# Altium project PCB_Divergence Meter.PrjPCB
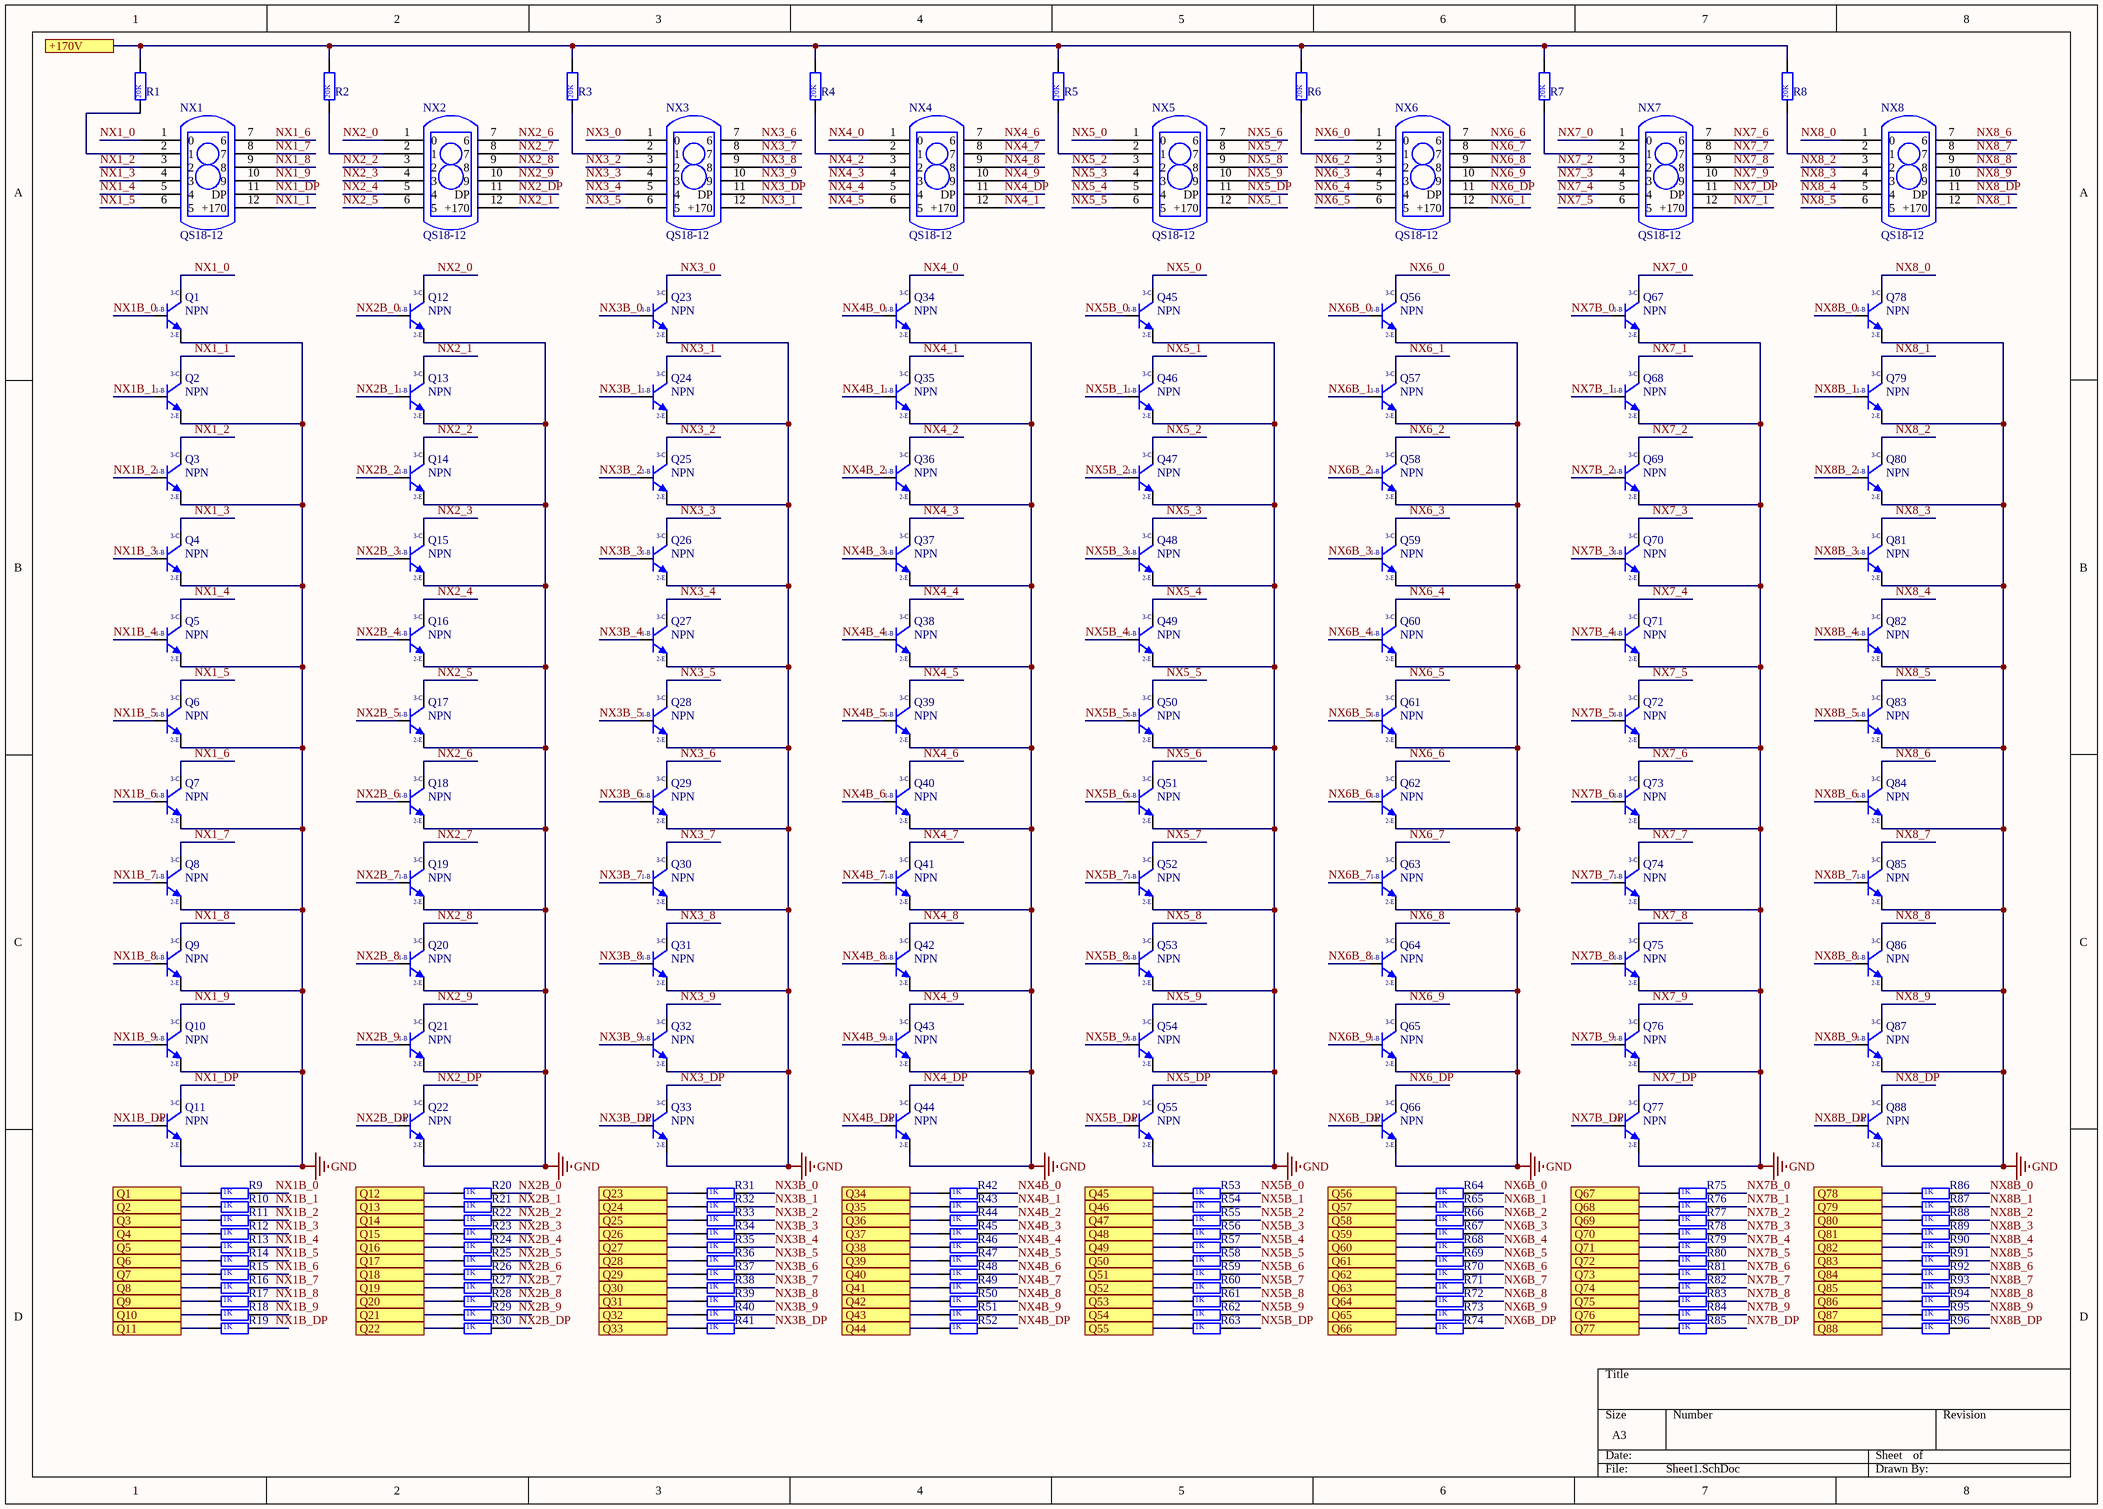
[diagram p0: Sheet1.SchDoc]
2 sheets, 224 parts. Net scope: flat (ports and power ports of the same name join across sheets).
Board file: PCB1.PcbDoc
Sheets:
  Sheet1.SchDoc
  Sheet2.SchDoc

## Sheet Sheet1.SchDoc
size A3

### Parts
NX1  QS18-12  [PCBComponent_1]
NX2  QS18-12  [PCBComponent_1]
NX3  QS18-12  [PCBComponent_1]
NX4  QS18-12  [PCBComponent_1]
NX5  QS18-12  [PCBComponent_1]
NX6  QS18-12  [PCBComponent_1]
NX7  QS18-12  [PCBComponent_1]
NX8  QS18-12  [PCBComponent_1]
Q1  NPN  [SOT-23]
Q2  NPN  [SOT-23]
Q3  NPN  [SOT-23]
Q4  NPN  [SOT-23]
Q5  NPN  [SOT-23]
Q6  NPN  [SOT-23]
Q7  NPN  [SOT-23]
Q8  NPN  [SOT-23]
Q9  NPN  [SOT-23]
Q10  NPN  [SOT-23]
Q11  NPN  [SOT-23]
Q12  NPN  [SOT-23]
Q13  NPN  [SOT-23]
Q14  NPN  [SOT-23]
Q15  NPN  [SOT-23]
Q16  NPN  [SOT-23]
Q17  NPN  [SOT-23]
Q18  NPN  [SOT-23]
Q19  NPN  [SOT-23]
Q20  NPN  [SOT-23]
Q21  NPN  [SOT-23]
Q22  NPN  [SOT-23]
Q23  NPN  [SOT-23]
Q24  NPN  [SOT-23]
Q25  NPN  [SOT-23]
Q26  NPN  [SOT-23]
Q27  NPN  [SOT-23]
Q28  NPN  [SOT-23]
Q29  NPN  [SOT-23]
Q30  NPN  [SOT-23]
Q31  NPN  [SOT-23]
Q32  NPN  [SOT-23]
Q33  NPN  [SOT-23]
Q34  NPN  [SOT-23]
Q35  NPN  [SOT-23]
Q36  NPN  [SOT-23]
Q37  NPN  [SOT-23]
Q38  NPN  [SOT-23]
Q39  NPN  [SOT-23]
Q40  NPN  [SOT-23]
Q41  NPN  [SOT-23]
Q42  NPN  [SOT-23]
Q43  NPN  [SOT-23]
Q44  NPN  [SOT-23]
Q45  NPN  [SOT-23]
Q46  NPN  [SOT-23]
Q47  NPN  [SOT-23]
Q48  NPN  [SOT-23]
Q49  NPN  [SOT-23]
Q50  NPN  [SOT-23]
Q51  NPN  [SOT-23]
Q52  NPN  [SOT-23]
Q53  NPN  [SOT-23]
Q54  NPN  [SOT-23]
Q55  NPN  [SOT-23]
Q56  NPN  [SOT-23]
Q57  NPN  [SOT-23]
Q58  NPN  [SOT-23]
Q59  NPN  [SOT-23]
Q60  NPN  [SOT-23]
Q61  NPN  [SOT-23]
Q62  NPN  [SOT-23]
Q63  NPN  [SOT-23]
Q64  NPN  [SOT-23]
Q65  NPN  [SOT-23]
Q66  NPN  [SOT-23]
Q67  NPN  [SOT-23]
Q68  NPN  [SOT-23]
Q69  NPN  [SOT-23]
Q70  NPN  [SOT-23]
Q71  NPN  [SOT-23]
Q72  NPN  [SOT-23]
Q73  NPN  [SOT-23]
Q74  NPN  [SOT-23]
Q75  NPN  [SOT-23]
Q76  NPN  [SOT-23]
Q77  NPN  [SOT-23]
Q78  NPN  [SOT-23]
Q79  NPN  [SOT-23]
Q80  NPN  [SOT-23]
Q81  NPN  [SOT-23]
Q82  NPN  [SOT-23]
Q83  NPN  [SOT-23]
Q84  NPN  [SOT-23]
Q85  NPN  [SOT-23]
Q86  NPN  [SOT-23]
Q87  NPN  [SOT-23]
Q88  NPN  [SOT-23]
R1  value 20K  [0805]  (hidden comment: R)
R2  value 20K  [0805]  (hidden comment: R)
R3  value 20K  [0805]  (hidden comment: R)
R4  value 20K  [0805]  (hidden comment: R)
R5  value 20K  [0805]  (hidden comment: R)
R6  value 20K  [0805]  (hidden comment: R)
R7  value 20K  [0805]  (hidden comment: R)
R8  value 20K  [0805]  (hidden comment: R)
R9  value 1K  [0805]  (hidden comment: R)
R10  value 1K  [0805]  (hidden comment: R)
R11  value 1K  [0805]  (hidden comment: R)
R12  value 1K  [0805]  (hidden comment: R)
R13  value 1K  [0805]  (hidden comment: R)
R14  value 1K  [0805]  (hidden comment: R)
R15  value 1K  [0805]  (hidden comment: R)
R16  value 1K  [0805]  (hidden comment: R)
R17  value 1K  [0805]  (hidden comment: R)
R18  value 1K  [0805]  (hidden comment: R)
R19  value 1K  [0805]  (hidden comment: R)
R20  value 1K  [0805]  (hidden comment: R)
R21  value 1K  [0805]  (hidden comment: R)
R22  value 1K  [0805]  (hidden comment: R)
R23  value 1K  [0805]  (hidden comment: R)
R24  value 1K  [0805]  (hidden comment: R)
R25  value 1K  [0805]  (hidden comment: R)
R26  value 1K  [0805]  (hidden comment: R)
R27  value 1K  [0805]  (hidden comment: R)
R28  value 1K  [0805]  (hidden comment: R)
R29  value 1K  [0805]  (hidden comment: R)
R30  value 1K  [0805]  (hidden comment: R)
R31  value 1K  [0805]  (hidden comment: R)
R32  value 1K  [0805]  (hidden comment: R)
R33  value 1K  [0805]  (hidden comment: R)
R34  value 1K  [0805]  (hidden comment: R)
R35  value 1K  [0805]  (hidden comment: R)
R36  value 1K  [0805]  (hidden comment: R)
R37  value 1K  [0805]  (hidden comment: R)
R38  value 1K  [0805]  (hidden comment: R)
R39  value 1K  [0805]  (hidden comment: R)
R40  value 1K  [0805]  (hidden comment: R)
R41  value 1K  [0805]  (hidden comment: R)
R42  value 1K  [0805]  (hidden comment: R)
R43  value 1K  [0805]  (hidden comment: R)
R44  value 1K  [0805]  (hidden comment: R)
R45  value 1K  [0805]  (hidden comment: R)
R46  value 1K  [0805]  (hidden comment: R)
R47  value 1K  [0805]  (hidden comment: R)
R48  value 1K  [0805]  (hidden comment: R)
R49  value 1K  [0805]  (hidden comment: R)
R50  value 1K  [0805]  (hidden comment: R)
R51  value 1K  [0805]  (hidden comment: R)
R52  value 1K  [0805]  (hidden comment: R)
R53  value 1K  [0805]  (hidden comment: R)
R54  value 1K  [0805]  (hidden comment: R)
R55  value 1K  [0805]  (hidden comment: R)
R56  value 1K  [0805]  (hidden comment: R)
R57  value 1K  [0805]  (hidden comment: R)
R58  value 1K  [0805]  (hidden comment: R)
R59  value 1K  [0805]  (hidden comment: R)
R60  value 1K  [0805]  (hidden comment: R)
R61  value 1K  [0805]  (hidden comment: R)
R62  value 1K  [0805]  (hidden comment: R)
R63  value 1K  [0805]  (hidden comment: R)
R64  value 1K  [0805]  (hidden comment: R)
R65  value 1K  [0805]  (hidden comment: R)
R66  value 1K  [0805]  (hidden comment: R)
R67  value 1K  [0805]  (hidden comment: R)
R68  value 1K  [0805]  (hidden comment: R)
R69  value 1K  [0805]  (hidden comment: R)
R70  value 1K  [0805]  (hidden comment: R)
R71  value 1K  [0805]  (hidden comment: R)
R72  value 1K  [0805]  (hidden comment: R)
R73  value 1K  [0805]  (hidden comment: R)
R74  value 1K  [0805]  (hidden comment: R)
R75  value 1K  [0805]  (hidden comment: R)
R76  value 1K  [0805]  (hidden comment: R)
R77  value 1K  [0805]  (hidden comment: R)
R78  value 1K  [0805]  (hidden comment: R)
R79  value 1K  [0805]  (hidden comment: R)
R80  value 1K  [0805]  (hidden comment: R)
R81  value 1K  [0805]  (hidden comment: R)
R82  value 1K  [0805]  (hidden comment: R)
R83  value 1K  [0805]  (hidden comment: R)
R84  value 1K  [0805]  (hidden comment: R)
R85  value 1K  [0805]  (hidden comment: R)
R86  value 1K  [0805]  (hidden comment: R)
R87  value 1K  [0805]  (hidden comment: R)
R88  value 1K  [0805]  (hidden comment: R)
R89  value 1K  [0805]  (hidden comment: R)
R90  value 1K  [0805]  (hidden comment: R)
R91  value 1K  [0805]  (hidden comment: R)
R92  value 1K  [0805]  (hidden comment: R)
R93  value 1K  [0805]  (hidden comment: R)
R94  value 1K  [0805]  (hidden comment: R)
R95  value 1K  [0805]  (hidden comment: R)
R96  value 1K  [0805]  (hidden comment: R)

### Ports
+170V, Q1, Q2, Q3, Q4, Q5, Q6, Q7, Q8, Q9, Q10, Q11, Q12, Q13, Q14, Q15, Q16, Q17, Q18, Q19, Q20, Q21, Q22, Q23, Q24, Q25, Q26, Q27, Q28, Q29, Q30, Q31, Q32, Q33, Q34, Q35, Q36, Q37, Q38, Q39, Q40, Q41, Q42, Q43, Q44, Q45, Q46, Q47, Q48, Q49, Q50, Q51, Q52, Q53, Q54, Q55, Q56, Q57, Q58, Q59, Q60, Q61, Q62, Q63, Q64, Q65, Q66, Q67, Q68, Q69, Q70, Q71, Q72, Q73, Q74, Q75, Q76, Q77, Q78, Q79, Q80, Q81, Q82, Q83, Q84, Q85, Q86, Q87, Q88

### Nets
GND: Q1.2(E) Q2.2(E) Q3.2(E) Q4.2(E) Q5.2(E) Q6.2(E) Q7.2(E) Q8.2(E) Q9.2(E) Q10.2(E) Q11.2(E) Q12.2(E) Q13.2(E) Q14.2(E) Q15.2(E) Q16.2(E) Q17.2(E) Q18.2(E) Q19.2(E) Q20.2(E) Q21.2(E) Q22.2(E) Q23.2(E) Q24.2(E) Q25.2(E) Q26.2(E) Q27.2(E) Q28.2(E) Q29.2(E) Q30.2(E) Q31.2(E) Q32.2(E) Q33.2(E) Q34.2(E) Q35.2(E) Q36.2(E) Q37.2(E) Q38.2(E) Q39.2(E) Q40.2(E) Q41.2(E) Q42.2(E) Q43.2(E) Q44.2(E) Q45.2(E) Q46.2(E) Q47.2(E) Q48.2(E) Q49.2(E) Q50.2(E) Q51.2(E) Q52.2(E) Q53.2(E) Q54.2(E) Q55.2(E) Q56.2(E) Q57.2(E) Q58.2(E) Q59.2(E) Q60.2(E) Q61.2(E) Q62.2(E) Q63.2(E) Q64.2(E) Q65.2(E) Q66.2(E) Q67.2(E) Q68.2(E) Q69.2(E) Q70.2(E) Q71.2(E) Q72.2(E) Q73.2(E) Q74.2(E) Q75.2(E) Q76.2(E) Q77.2(E) Q78.2(E) Q79.2(E) Q80.2(E) Q81.2(E) Q82.2(E) Q83.2(E) Q84.2(E) Q85.2(E) Q86.2(E) Q87.2(E) Q88.2(E)
NX1_0: NX1.1(0) Q1.3(C)
NX1_1: NX1.12(+170) Q2.3(C)
NX1_2: NX1.3(2) Q3.3(C)
NX1_3: NX1.4(3) Q4.3(C)
NX1_4: NX1.5(4) Q5.3(C)
NX1_5: NX1.6(5) Q6.3(C)
NX1_6: NX1.7(6) Q7.3(C)
NX1_7: NX1.8(7) Q8.3(C)
NX1_8: NX1.9(8) Q9.3(C)
NX1_9: NX1.10(9) Q10.3(C)
NX1_DP: NX1.11(DP) Q11.3(C)
NX1B_0: Q1.1(B) R9.2
NX1B_1: Q2.1(B) R10.2
NX1B_2: Q3.1(B) R11.2
NX1B_3: Q4.1(B) R12.2
NX1B_4: Q5.1(B) R13.2
NX1B_5: Q6.1(B) R14.2
NX1B_6: Q7.1(B) R15.2
NX1B_7: Q8.1(B) R16.2
NX1B_8: Q9.1(B) R17.2
NX1B_9: Q10.1(B) R18.2
NX1B_DP: Q11.1(B) R19.2
NX2_0: NX2.1(0) Q12.3(C)
NX2_1: NX2.12(+170) Q13.3(C)
NX2_2: NX2.3(2) Q14.3(C)
NX2_3: NX2.4(3) Q15.3(C)
NX2_4: NX2.5(4) Q16.3(C)
NX2_5: NX2.6(5) Q17.3(C)
NX2_6: NX2.7(6) Q18.3(C)
NX2_7: NX2.8(7) Q19.3(C)
NX2_8: NX2.9(8) Q20.3(C)
NX2_9: NX2.10(9) Q21.3(C)
NX2_DP: NX2.11(DP) Q22.3(C)
NX2B_0: Q12.1(B) R20.2
NX2B_1: Q13.1(B) R21.2
NX2B_2: Q14.1(B) R22.2
NX2B_3: Q15.1(B) R23.2
NX2B_4: Q16.1(B) R24.2
NX2B_5: Q17.1(B) R25.2
NX2B_6: Q18.1(B) R26.2
NX2B_7: Q19.1(B) R27.2
NX2B_8: Q20.1(B) R28.2
NX2B_9: Q21.1(B) R29.2
NX2B_DP: Q22.1(B) R30.2
NX3_0: NX3.1(0) Q23.3(C)
NX3_1: NX3.12(+170) Q24.3(C)
NX3_2: NX3.3(2) Q25.3(C)
NX3_3: NX3.4(3) Q26.3(C)
NX3_4: NX3.5(4) Q27.3(C)
NX3_5: NX3.6(5) Q28.3(C)
NX3_6: NX3.7(6) Q29.3(C)
NX3_7: NX3.8(7) Q30.3(C)
NX3_8: NX3.9(8) Q31.3(C)
NX3_9: NX3.10(9) Q32.3(C)
NX3_DP: NX3.11(DP) Q33.3(C)
NX3B_0: Q23.1(B) R31.2
NX3B_1: Q24.1(B) R32.2
NX3B_2: Q25.1(B) R33.2
NX3B_3: Q26.1(B) R34.2
NX3B_4: Q27.1(B) R35.2
NX3B_5: Q28.1(B) R36.2
NX3B_6: Q29.1(B) R37.2
NX3B_7: Q30.1(B) R38.2
NX3B_8: Q31.1(B) R39.2
NX3B_9: Q32.1(B) R40.2
NX3B_DP: Q33.1(B) R41.2
NX4_0: NX4.1(0) Q34.3(C)
NX4_1: NX4.12(+170) Q35.3(C)
NX4_2: NX4.3(2) Q36.3(C)
NX4_3: NX4.4(3) Q37.3(C)
NX4_4: NX4.5(4) Q38.3(C)
NX4_5: NX4.6(5) Q39.3(C)
NX4_6: NX4.7(6) Q40.3(C)
NX4_7: NX4.8(7) Q41.3(C)
NX4_8: NX4.9(8) Q42.3(C)
NX4_9: NX4.10(9) Q43.3(C)
NX4_DP: NX4.11(DP) Q44.3(C)
NX4B_0: Q34.1(B) R42.2
NX4B_1: Q35.1(B) R43.2
NX4B_2: Q36.1(B) R44.2
NX4B_3: Q37.1(B) R45.2
NX4B_4: Q38.1(B) R46.2
NX4B_5: Q39.1(B) R47.2
NX4B_6: Q40.1(B) R48.2
NX4B_7: Q41.1(B) R49.2
NX4B_8: Q42.1(B) R50.2
NX4B_9: Q43.1(B) R51.2
NX4B_DP: Q44.1(B) R52.2
NX5_0: NX5.1(0) Q45.3(C)
NX5_1: NX5.12(+170) Q46.3(C)
NX5_2: NX5.3(2) Q47.3(C)
NX5_3: NX5.4(3) Q48.3(C)
NX5_4: NX5.5(4) Q49.3(C)
NX5_5: NX5.6(5) Q50.3(C)
NX5_6: NX5.7(6) Q51.3(C)
NX5_7: NX5.8(7) Q52.3(C)
NX5_8: NX5.9(8) Q53.3(C)
NX5_9: NX5.10(9) Q54.3(C)
NX5_DP: NX5.11(DP) Q55.3(C)
NX5B_0: Q45.1(B) R53.2
NX5B_1: Q46.1(B) R54.2
NX5B_2: Q47.1(B) R55.2
NX5B_3: Q48.1(B) R56.2
NX5B_4: Q49.1(B) R57.2
NX5B_5: Q50.1(B) R58.2
NX5B_6: Q51.1(B) R59.2
NX5B_7: Q52.1(B) R60.2
NX5B_8: Q53.1(B) R61.2
NX5B_9: Q54.1(B) R62.2
NX5B_DP: Q55.1(B) R63.2
NX6_0: NX6.1(0) Q56.3(C)
NX6_1: NX6.12(+170) Q57.3(C)
NX6_2: NX6.3(2) Q58.3(C)
NX6_3: NX6.4(3) Q59.3(C)
NX6_4: NX6.5(4) Q60.3(C)
NX6_5: NX6.6(5) Q61.3(C)
NX6_6: NX6.7(6) Q62.3(C)
NX6_7: NX6.8(7) Q63.3(C)
NX6_8: NX6.9(8) Q64.3(C)
NX6_9: NX6.10(9) Q65.3(C)
NX6_DP: NX6.11(DP) Q66.3(C)
NX6B_0: Q56.1(B) R64.2
NX6B_1: Q57.1(B) R65.2
NX6B_2: Q58.1(B) R66.2
NX6B_3: Q59.1(B) R67.2
NX6B_4: Q60.1(B) R68.2
NX6B_5: Q61.1(B) R69.2
NX6B_6: Q62.1(B) R70.2
NX6B_7: Q63.1(B) R71.2
NX6B_8: Q64.1(B) R72.2
NX6B_9: Q65.1(B) R73.2
NX6B_DP: Q66.1(B) R74.2
NX7_0: NX7.1(0) Q67.3(C)
NX7_1: NX7.12(+170) Q68.3(C)
NX7_2: NX7.3(2) Q69.3(C)
NX7_3: NX7.4(3) Q70.3(C)
NX7_4: NX7.5(4) Q71.3(C)
NX7_5: NX7.6(5) Q72.3(C)
NX7_6: NX7.7(6) Q73.3(C)
NX7_7: NX7.8(7) Q74.3(C)
NX7_8: NX7.9(8) Q75.3(C)
NX7_9: NX7.10(9) Q76.3(C)
NX7_DP: NX7.11(DP) Q77.3(C)
NX7B_0: Q67.1(B) R75.2
NX7B_1: Q68.1(B) R76.2
NX7B_2: Q69.1(B) R77.2
NX7B_3: Q70.1(B) R78.2
NX7B_4: Q71.1(B) R79.2
NX7B_5: Q72.1(B) R80.2
NX7B_6: Q73.1(B) R81.2
NX7B_7: Q74.1(B) R82.2
NX7B_8: Q75.1(B) R83.2
NX7B_9: Q76.1(B) R84.2
NX7B_DP: Q77.1(B) R85.2
NX8_0: NX8.1(0) Q78.3(C)
NX8_1: NX8.12(+170) Q79.3(C)
NX8_2: NX8.3(2) Q80.3(C)
NX8_3: NX8.4(3) Q81.3(C)
NX8_4: NX8.5(4) Q82.3(C)
NX8_5: NX8.6(5) Q83.3(C)
NX8_6: NX8.7(6) Q84.3(C)
NX8_7: NX8.8(7) Q85.3(C)
NX8_8: NX8.9(8) Q86.3(C)
NX8_9: NX8.10(9) Q87.3(C)
NX8_DP: NX8.11(DP) Q88.3(C)
NX8B_0: Q78.1(B) R86.2
NX8B_1: Q79.1(B) R87.2
NX8B_2: Q80.1(B) R88.2
NX8B_3: Q81.1(B) R89.2
NX8B_4: Q82.1(B) R90.2
NX8B_5: Q83.1(B) R91.2
NX8B_6: Q84.1(B) R92.2
NX8B_7: Q85.1(B) R93.2
NX8B_8: Q86.1(B) R94.2
NX8B_9: Q87.1(B) R95.2
NX8B_DP: Q88.1(B) R96.2
NetNX1_2: NX1.2(1) R1.1
NetNX2_2: NX2.2(1) R2.1
NetNX3_2: NX3.2(1) R3.1
NetNX4_2: NX4.2(1) R4.1
NetNX5_2: NX5.2(1) R5.1
NetNX6_2: NX6.2(1) R6.1
NetNX7_2: NX7.2(1) R7.1
NetNX8_2: NX8.2(1) R8.1
NetP1_8: R1.2 R2.2 R3.2 R4.2 R5.2 R6.2 R7.2 R8.2 ; port +170V
NetR9_1: R9.1 ; port Q1
NetR10_1: R10.1 ; port Q2
NetR11_1: R11.1 ; port Q3
NetR12_1: R12.1 ; port Q4
NetR13_1: R13.1 ; port Q5
NetR14_1: R14.1 ; port Q6
NetR15_1: R15.1 ; port Q7
NetR16_1: R16.1 ; port Q8
NetR17_1: R17.1 ; port Q9
NetR18_1: R18.1 ; port Q10
NetR19_1: R19.1 ; port Q11
NetR20_1: R20.1 ; port Q12
NetR21_1: R21.1 ; port Q13
NetR22_1: R22.1 ; port Q14
NetR23_1: R23.1 ; port Q15
NetR24_1: R24.1 ; port Q16
NetR25_1: R25.1 ; port Q17
NetR26_1: R26.1 ; port Q18
NetR27_1: R27.1 ; port Q19
NetR28_1: R28.1 ; port Q20
NetR29_1: R29.1 ; port Q21
NetR30_1: R30.1 ; port Q22
NetR31_1: R31.1 ; port Q23
NetR32_1: R32.1 ; port Q24
NetR33_1: R33.1 ; port Q25
NetR34_1: R34.1 ; port Q26
NetR35_1: R35.1 ; port Q27
NetR36_1: R36.1 ; port Q28
NetR37_1: R37.1 ; port Q29
NetR38_1: R38.1 ; port Q30
NetR39_1: R39.1 ; port Q31
NetR40_1: R40.1 ; port Q32
NetR41_1: R41.1 ; port Q33
NetR42_1: R42.1 ; port Q34
NetR43_1: R43.1 ; port Q35
NetR44_1: R44.1 ; port Q36
NetR45_1: R45.1 ; port Q37
NetR46_1: R46.1 ; port Q38
NetR47_1: R47.1 ; port Q39
NetR48_1: R48.1 ; port Q40
NetR49_1: R49.1 ; port Q41
NetR50_1: R50.1 ; port Q42
NetR51_1: R51.1 ; port Q43
NetR52_1: R52.1 ; port Q44
NetR53_1: R53.1 ; port Q45
NetR54_1: R54.1 ; port Q46
NetR55_1: R55.1 ; port Q47
NetR56_1: R56.1 ; port Q48
NetR57_1: R57.1 ; port Q49
NetR58_1: R58.1 ; port Q50
NetR59_1: R59.1 ; port Q51
NetR60_1: R60.1 ; port Q52
NetR61_1: R61.1 ; port Q53
NetR62_1: R62.1 ; port Q54
NetR63_1: R63.1 ; port Q55
NetR64_1: R64.1 ; port Q56
NetR65_1: R65.1 ; port Q57
NetR66_1: R66.1 ; port Q58
NetR67_1: R67.1 ; port Q59
NetR68_1: R68.1 ; port Q60
NetR69_1: R69.1 ; port Q61
NetR70_1: R70.1 ; port Q62
NetR71_1: R71.1 ; port Q63
NetR72_1: R72.1 ; port Q64
NetR73_1: R73.1 ; port Q65
NetR74_1: R74.1 ; port Q66
NetR75_1: R75.1 ; port Q67
NetR76_1: R76.1 ; port Q68
NetR77_1: R77.1 ; port Q69
NetR78_1: R78.1 ; port Q70
NetR79_1: R79.1 ; port Q71
NetR80_1: R80.1 ; port Q72
NetR81_1: R81.1 ; port Q73
NetR82_1: R82.1 ; port Q74
NetR83_1: R83.1 ; port Q75
NetR84_1: R84.1 ; port Q76
NetR85_1: R85.1 ; port Q77
NetR86_1: R86.1 ; port Q78
NetR87_1: R87.1 ; port Q79
NetR88_1: R88.1 ; port Q80
NetR89_1: R89.1 ; port Q81
NetR90_1: R90.1 ; port Q82
NetR91_1: R91.1 ; port Q83
NetR92_1: R92.1 ; port Q84
NetR93_1: R93.1 ; port Q85
NetR94_1: R94.1 ; port Q86
NetR95_1: R95.1 ; port Q87
NetR96_1: R96.1 ; port Q88

### Notes on the sheet
- (in symbol NPN-S8050-SOT-23) 3-C; 1-B; 2-E

### Library data of the parts
Q1-Q88 = NPN-S8050-SOT-23

## Sheet Sheet2.SchDoc
size A4
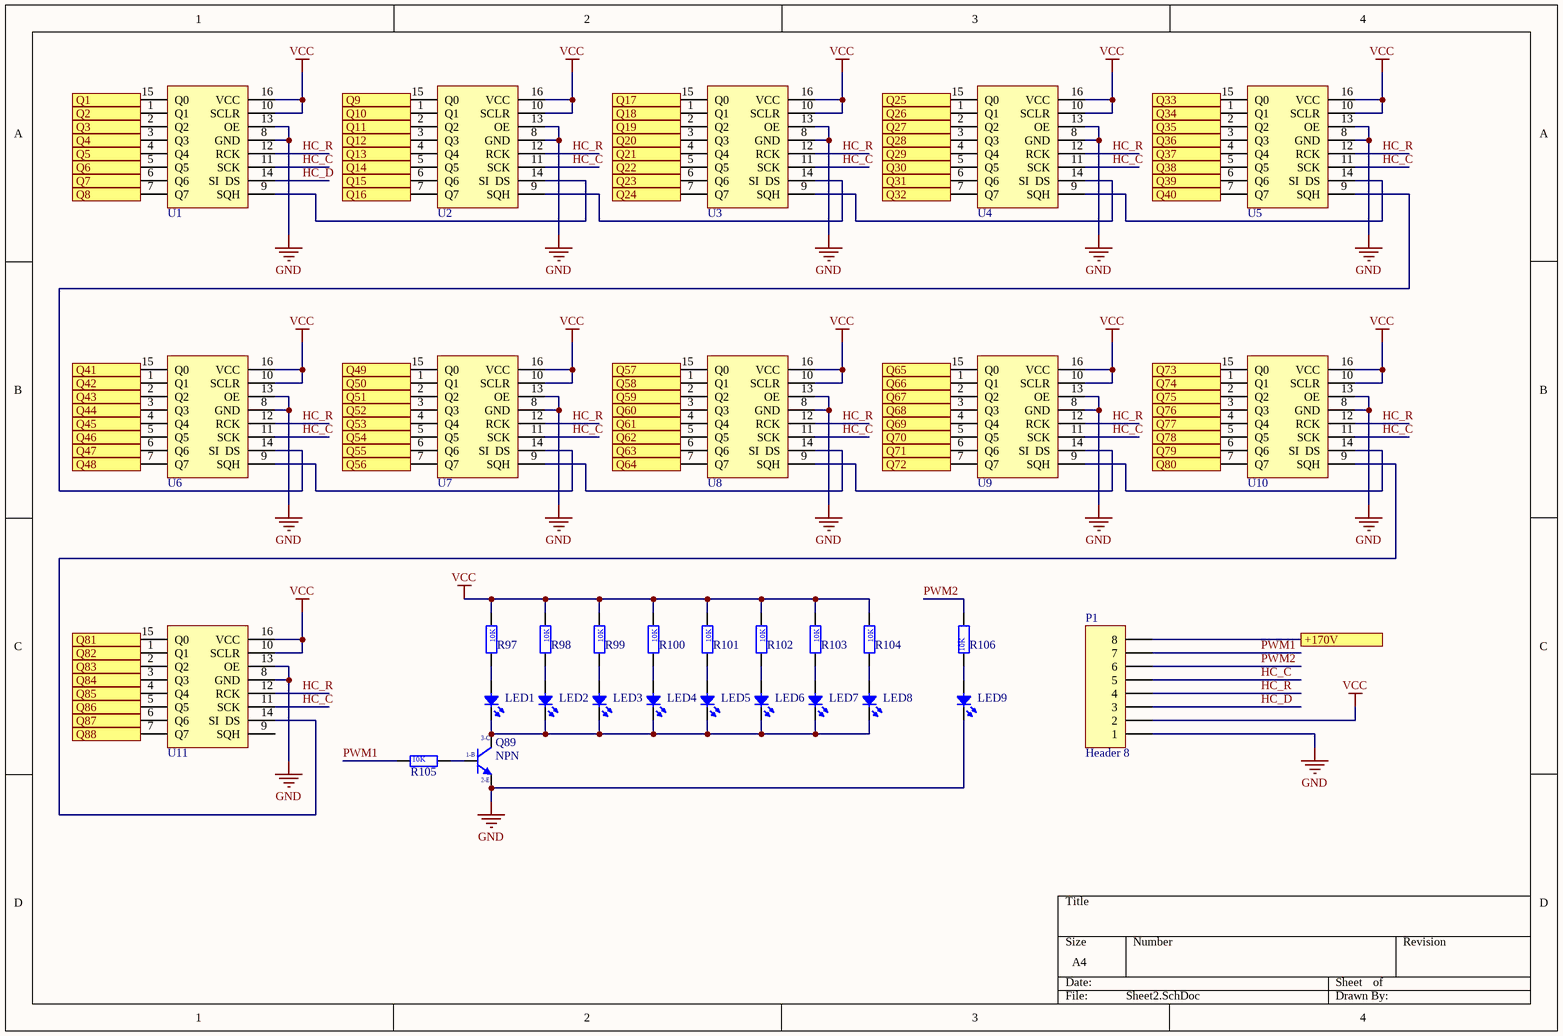
[diagram p1: Sheet2.SchDoc]

### Parts
LED1  LED  [0805D]  (value not drawn)
LED2  LED  [0805D]  (value not drawn)
LED3  LED  [0805D]  (value not drawn)
LED4  LED  [0805D]  (value not drawn)
LED5  LED  [0805D]  (value not drawn)
LED6  LED  [0805D]  (value not drawn)
LED7  LED  [0805D]  (value not drawn)
LED8  LED  [0805D]  (value not drawn)
LED9  LED  [0805D]  (value not drawn)
P1  Header 8  [HDR1X8]
Q89  NPN  [SOT-23]
R97  value 10K  [0805]  (hidden comment: R)
R98  value 10K  [0805]  (hidden comment: R)
R99  value 10K  [0805]  (hidden comment: R)
R100  value 10K  [0805]  (hidden comment: R)
R101  value 10K  [0805]  (hidden comment: R)
R102  value 10K  [0805]  (hidden comment: R)
R103  value 10K  [0805]  (hidden comment: R)
R104  value 10K  [0805]  (hidden comment: R)
R105  value 10K  [0805]  (hidden comment: R)
R106  value 10K  [0805]  (hidden comment: R)
U1  74HC595  [SOP-16]  (value not drawn)
U2  74HC595  [SOP-16]  (value not drawn)
U3  74HC595  [SOP-16]  (value not drawn)
U4  74HC595  [SOP-16]  (value not drawn)
U5  74HC595  [SOP-16]  (value not drawn)
U6  74HC595  [SOP-16]  (value not drawn)
U7  74HC595  [SOP-16]  (value not drawn)
U8  74HC595  [SOP-16]  (value not drawn)
U9  74HC595  [SOP-16]  (value not drawn)
U10  74HC595  [SOP-16]  (value not drawn)
U11  74HC595  [SOP-16]  (value not drawn)

### Ports
+170V, Q1, Q2, Q3, Q4, Q5, Q6, Q7, Q8, Q9, Q10, Q11, Q12, Q13, Q14, Q15, Q16, Q17, Q18, Q19, Q20, Q21, Q22, Q23, Q24, Q25, Q26, Q27, Q28, Q29, Q30, Q31, Q32, Q33, Q34, Q35, Q36, Q37, Q38, Q39, Q40, Q41, Q42, Q43, Q44, Q45, Q46, Q47, Q48, Q49, Q50, Q51, Q52, Q53, Q54, Q55, Q56, Q57, Q58, Q59, Q60, Q61, Q62, Q63, Q64, Q65, Q66, Q67, Q68, Q69, Q70, Q71, Q72, Q73, Q74, Q75, Q76, Q77, Q78, Q79, Q80, Q81, Q82, Q83, Q84, Q85, Q86, Q87, Q88

### Nets
GND: LED9.2(K) P1.1 Q89.2(E) U1.8(GND) U1.13(OE) U2.8(GND) U2.13(OE) U3.8(GND) U3.13(OE) U4.8(GND) U4.13(OE) U5.8(GND) U5.13(OE) U6.8(GND) U6.13(OE) U7.8(GND) U7.13(OE) U8.8(GND) U8.13(OE) U9.8(GND) U9.13(OE) U10.8(GND) U10.13(OE) U11.8(GND) U11.13(OE)
VCC: P1.2 R97.1 R98.1 R99.1 R100.1 R101.1 R102.1 R103.1 R104.1 U1.10(SCLR) U1.16(VCC) U2.10(SCLR) U2.16(VCC) U3.10(SCLR) U3.16(VCC) U4.10(SCLR) U4.16(VCC) U5.10(SCLR) U5.16(VCC) U6.10(SCLR) U6.16(VCC) U7.10(SCLR) U7.16(VCC) U8.10(SCLR) U8.16(VCC) U9.10(SCLR) U9.16(VCC) U10.10(SCLR) U10.16(VCC) U11.10(SCLR) U11.16(VCC)
HC_C: P1.5 U1.11(SCK) U2.11(SCK) U3.11(SCK) U4.11(SCK) U5.11(SCK) U6.11(SCK) U7.11(SCK) U8.11(SCK) U9.11(SCK) U10.11(SCK) U11.11(SCK)
HC_D: P1.3 U1.14(SI__DS)
HC_R: P1.4 U1.12(RCK) U2.12(RCK) U3.12(RCK) U4.12(RCK) U5.12(RCK) U6.12(RCK) U7.12(RCK) U8.12(RCK) U9.12(RCK) U10.12(RCK) U11.12(RCK)
PWM1: P1.7 R105.1
PWM2: P1.6 R106.2
NetLED1_1: LED1.1(A) R97.2
NetLED1_2: LED1.2(K) LED2.2(K) LED3.2(K) LED4.2(K) LED5.2(K) LED6.2(K) LED7.2(K) LED8.2(K) Q89.3(C)
NetLED2_1: LED2.1(A) R98.2
NetLED3_1: LED3.1(A) R99.2
NetLED4_1: LED4.1(A) R100.2
NetLED5_1: LED5.1(A) R101.2
NetLED6_1: LED6.1(A) R102.2
NetLED7_1: LED7.1(A) R103.2
NetLED8_1: LED8.1(A) R104.2
NetLED9_1: LED9.1(A) R106.1
NetP1_8: P1.8 ; port +170V
NetQ89_1: Q89.1(B) R105.2
NetR9_1: U1.15(Q0) ; port Q1
NetR10_1: U1.1(Q1) ; port Q2
NetR11_1: U1.2(Q2) ; port Q3
NetR12_1: U1.3(Q3) ; port Q4
NetR13_1: U1.4(Q4) ; port Q5
NetR14_1: U1.5(Q5) ; port Q6
NetR15_1: U1.6(Q6) ; port Q7
NetR16_1: U1.7(Q7) ; port Q8
NetR17_1: U2.15(Q0) ; port Q9
NetR18_1: U2.1(Q1) ; port Q10
NetR19_1: U2.2(Q2) ; port Q11
NetR20_1: U2.3(Q3) ; port Q12
NetR21_1: U2.4(Q4) ; port Q13
NetR22_1: U2.5(Q5) ; port Q14
NetR23_1: U2.6(Q6) ; port Q15
NetR24_1: U2.7(Q7) ; port Q16
NetR25_1: U3.15(Q0) ; port Q17
NetR26_1: U3.1(Q1) ; port Q18
NetR27_1: U3.2(Q2) ; port Q19
NetR28_1: U3.3(Q3) ; port Q20
NetR29_1: U3.4(Q4) ; port Q21
NetR30_1: U3.5(Q5) ; port Q22
NetR31_1: U3.6(Q6) ; port Q23
NetR32_1: U3.7(Q7) ; port Q24
NetR33_1: U4.15(Q0) ; port Q25
NetR34_1: U4.1(Q1) ; port Q26
NetR35_1: U4.2(Q2) ; port Q27
NetR36_1: U4.3(Q3) ; port Q28
NetR37_1: U4.4(Q4) ; port Q29
NetR38_1: U4.5(Q5) ; port Q30
NetR39_1: U4.6(Q6) ; port Q31
NetR40_1: U4.7(Q7) ; port Q32
NetR41_1: U5.15(Q0) ; port Q33
NetR42_1: U5.1(Q1) ; port Q34
NetR43_1: U5.2(Q2) ; port Q35
NetR44_1: U5.3(Q3) ; port Q36
NetR45_1: U5.4(Q4) ; port Q37
NetR46_1: U5.5(Q5) ; port Q38
NetR47_1: U5.6(Q6) ; port Q39
NetR48_1: U5.7(Q7) ; port Q40
NetR49_1: U6.15(Q0) ; port Q41
NetR50_1: U6.1(Q1) ; port Q42
NetR51_1: U6.2(Q2) ; port Q43
NetR52_1: U6.3(Q3) ; port Q44
NetR53_1: U6.4(Q4) ; port Q45
NetR54_1: U6.5(Q5) ; port Q46
NetR55_1: U6.6(Q6) ; port Q47
NetR56_1: U6.7(Q7) ; port Q48
NetR57_1: U7.15(Q0) ; port Q49
NetR58_1: U7.1(Q1) ; port Q50
NetR59_1: U7.2(Q2) ; port Q51
NetR60_1: U7.3(Q3) ; port Q52
NetR61_1: U7.4(Q4) ; port Q53
NetR62_1: U7.5(Q5) ; port Q54
NetR63_1: U7.6(Q6) ; port Q55
NetR64_1: U7.7(Q7) ; port Q56
NetR65_1: U8.15(Q0) ; port Q57
NetR66_1: U8.1(Q1) ; port Q58
NetR67_1: U8.2(Q2) ; port Q59
NetR68_1: U8.3(Q3) ; port Q60
NetR69_1: U8.4(Q4) ; port Q61
NetR70_1: U8.5(Q5) ; port Q62
NetR71_1: U8.6(Q6) ; port Q63
NetR72_1: U8.7(Q7) ; port Q64
NetR73_1: U9.15(Q0) ; port Q65
NetR74_1: U9.1(Q1) ; port Q66
NetR75_1: U9.2(Q2) ; port Q67
NetR76_1: U9.3(Q3) ; port Q68
NetR77_1: U9.4(Q4) ; port Q69
NetR78_1: U9.5(Q5) ; port Q70
NetR79_1: U9.6(Q6) ; port Q71
NetR80_1: U9.7(Q7) ; port Q72
NetR81_1: U10.15(Q0) ; port Q73
NetR82_1: U10.1(Q1) ; port Q74
NetR83_1: U10.2(Q2) ; port Q75
NetR84_1: U10.3(Q3) ; port Q76
NetR85_1: U10.4(Q4) ; port Q77
NetR86_1: U10.5(Q5) ; port Q78
NetR87_1: U10.6(Q6) ; port Q79
NetR88_1: U10.7(Q7) ; port Q80
NetR89_1: U11.15(Q0) ; port Q81
NetR90_1: U11.1(Q1) ; port Q82
NetR91_1: U11.2(Q2) ; port Q83
NetR92_1: U11.3(Q3) ; port Q84
NetR93_1: U11.4(Q4) ; port Q85
NetR94_1: U11.5(Q5) ; port Q86
NetR95_1: U11.6(Q6) ; port Q87
NetR96_1: U11.7(Q7) ; port Q88
NetU1_9: U1.9(SQH) U2.14(SI__DS)
NetU2_9: U2.9(SQH) U3.14(SI__DS)
NetU3_9: U3.9(SQH) U4.14(SI__DS)
NetU4_9: U4.9(SQH) U5.14(SI__DS)
NetU5_9: U5.9(SQH) U6.14(SI__DS)
NetU6_9: U6.9(SQH) U7.14(SI__DS)
NetU7_9: U7.9(SQH) U8.14(SI__DS)
NetU8_9: U8.9(SQH) U9.14(SI__DS)
NetU9_9: U9.9(SQH) U10.14(SI__DS)
NetU10_9: U10.9(SQH) U11.14(SI__DS)

Not connected (* = marked no-connect by the designer): U11 9(SQH)

### Notes on the sheet
- (in symbol NPN-S8050-SOT-23) 3-C; 1-B; 2-E

### Library data of the parts
P1 = Header 8: Header, 8-Pin; LatestRevisionDate: 17-Jul-2002; LatestRevisionNote: Re-released for DXP Platform.; Publisher: Altium Limited
Q89 = NPN-S8050-SOT-23
U1-U11 = 74HC595_1
LED1-LED9 = LED: Published: 8-Jun-2000; LatestRevisionDate: 08-Jul-2005; LatestRevisionNote: Mech Layer 1 removed.; PackageReference: LED-0; Publisher: Altium Limited; PackageDescription: LED; 2 Leads

## Nets that join several sheets
GND: Sheet1 (88 pins), Sheet2 (25 pins)
NetP1_8: Sheet1 (8 pins), Sheet2 (P1.8)
NetR9_1: Sheet1 (R9.1), Sheet2 (U1.15)
NetR10_1: Sheet1 (R10.1), Sheet2 (U1.1)
NetR11_1: Sheet1 (R11.1), Sheet2 (U1.2)
NetR12_1: Sheet1 (R12.1), Sheet2 (U1.3)
NetR13_1: Sheet1 (R13.1), Sheet2 (U1.4)
NetR14_1: Sheet1 (R14.1), Sheet2 (U1.5)
NetR15_1: Sheet1 (R15.1), Sheet2 (U1.6)
NetR16_1: Sheet1 (R16.1), Sheet2 (U1.7)
NetR17_1: Sheet1 (R17.1), Sheet2 (U2.15)
NetR18_1: Sheet1 (R18.1), Sheet2 (U2.1)
NetR19_1: Sheet1 (R19.1), Sheet2 (U2.2)
NetR20_1: Sheet1 (R20.1), Sheet2 (U2.3)
NetR21_1: Sheet1 (R21.1), Sheet2 (U2.4)
NetR22_1: Sheet1 (R22.1), Sheet2 (U2.5)
NetR23_1: Sheet1 (R23.1), Sheet2 (U2.6)
NetR24_1: Sheet1 (R24.1), Sheet2 (U2.7)
NetR25_1: Sheet1 (R25.1), Sheet2 (U3.15)
NetR26_1: Sheet1 (R26.1), Sheet2 (U3.1)
NetR27_1: Sheet1 (R27.1), Sheet2 (U3.2)
NetR28_1: Sheet1 (R28.1), Sheet2 (U3.3)
NetR29_1: Sheet1 (R29.1), Sheet2 (U3.4)
NetR30_1: Sheet1 (R30.1), Sheet2 (U3.5)
NetR31_1: Sheet1 (R31.1), Sheet2 (U3.6)
NetR32_1: Sheet1 (R32.1), Sheet2 (U3.7)
NetR33_1: Sheet1 (R33.1), Sheet2 (U4.15)
NetR34_1: Sheet1 (R34.1), Sheet2 (U4.1)
NetR35_1: Sheet1 (R35.1), Sheet2 (U4.2)
NetR36_1: Sheet1 (R36.1), Sheet2 (U4.3)
NetR37_1: Sheet1 (R37.1), Sheet2 (U4.4)
NetR38_1: Sheet1 (R38.1), Sheet2 (U4.5)
NetR39_1: Sheet1 (R39.1), Sheet2 (U4.6)
NetR40_1: Sheet1 (R40.1), Sheet2 (U4.7)
NetR41_1: Sheet1 (R41.1), Sheet2 (U5.15)
NetR42_1: Sheet1 (R42.1), Sheet2 (U5.1)
NetR43_1: Sheet1 (R43.1), Sheet2 (U5.2)
NetR44_1: Sheet1 (R44.1), Sheet2 (U5.3)
NetR45_1: Sheet1 (R45.1), Sheet2 (U5.4)
NetR46_1: Sheet1 (R46.1), Sheet2 (U5.5)
NetR47_1: Sheet1 (R47.1), Sheet2 (U5.6)
NetR48_1: Sheet1 (R48.1), Sheet2 (U5.7)
NetR49_1: Sheet1 (R49.1), Sheet2 (U6.15)
NetR50_1: Sheet1 (R50.1), Sheet2 (U6.1)
NetR51_1: Sheet1 (R51.1), Sheet2 (U6.2)
NetR52_1: Sheet1 (R52.1), Sheet2 (U6.3)
NetR53_1: Sheet1 (R53.1), Sheet2 (U6.4)
NetR54_1: Sheet1 (R54.1), Sheet2 (U6.5)
NetR55_1: Sheet1 (R55.1), Sheet2 (U6.6)
NetR56_1: Sheet1 (R56.1), Sheet2 (U6.7)
NetR57_1: Sheet1 (R57.1), Sheet2 (U7.15)
NetR58_1: Sheet1 (R58.1), Sheet2 (U7.1)
NetR59_1: Sheet1 (R59.1), Sheet2 (U7.2)
NetR60_1: Sheet1 (R60.1), Sheet2 (U7.3)
NetR61_1: Sheet1 (R61.1), Sheet2 (U7.4)
NetR62_1: Sheet1 (R62.1), Sheet2 (U7.5)
NetR63_1: Sheet1 (R63.1), Sheet2 (U7.6)
NetR64_1: Sheet1 (R64.1), Sheet2 (U7.7)
NetR65_1: Sheet1 (R65.1), Sheet2 (U8.15)
NetR66_1: Sheet1 (R66.1), Sheet2 (U8.1)
NetR67_1: Sheet1 (R67.1), Sheet2 (U8.2)
NetR68_1: Sheet1 (R68.1), Sheet2 (U8.3)
NetR69_1: Sheet1 (R69.1), Sheet2 (U8.4)
NetR70_1: Sheet1 (R70.1), Sheet2 (U8.5)
NetR71_1: Sheet1 (R71.1), Sheet2 (U8.6)
NetR72_1: Sheet1 (R72.1), Sheet2 (U8.7)
NetR73_1: Sheet1 (R73.1), Sheet2 (U9.15)
NetR74_1: Sheet1 (R74.1), Sheet2 (U9.1)
NetR75_1: Sheet1 (R75.1), Sheet2 (U9.2)
NetR76_1: Sheet1 (R76.1), Sheet2 (U9.3)
NetR77_1: Sheet1 (R77.1), Sheet2 (U9.4)
NetR78_1: Sheet1 (R78.1), Sheet2 (U9.5)
NetR79_1: Sheet1 (R79.1), Sheet2 (U9.6)
NetR80_1: Sheet1 (R80.1), Sheet2 (U9.7)
NetR81_1: Sheet1 (R81.1), Sheet2 (U10.15)
NetR82_1: Sheet1 (R82.1), Sheet2 (U10.1)
NetR83_1: Sheet1 (R83.1), Sheet2 (U10.2)
NetR84_1: Sheet1 (R84.1), Sheet2 (U10.3)
NetR85_1: Sheet1 (R85.1), Sheet2 (U10.4)
NetR86_1: Sheet1 (R86.1), Sheet2 (U10.5)
NetR87_1: Sheet1 (R87.1), Sheet2 (U10.6)
NetR88_1: Sheet1 (R88.1), Sheet2 (U10.7)
NetR89_1: Sheet1 (R89.1), Sheet2 (U11.15)
NetR90_1: Sheet1 (R90.1), Sheet2 (U11.1)
NetR91_1: Sheet1 (R91.1), Sheet2 (U11.2)
NetR92_1: Sheet1 (R92.1), Sheet2 (U11.3)
NetR93_1: Sheet1 (R93.1), Sheet2 (U11.4)
NetR94_1: Sheet1 (R94.1), Sheet2 (U11.5)
NetR95_1: Sheet1 (R95.1), Sheet2 (U11.6)
NetR96_1: Sheet1 (R96.1), Sheet2 (U11.7)